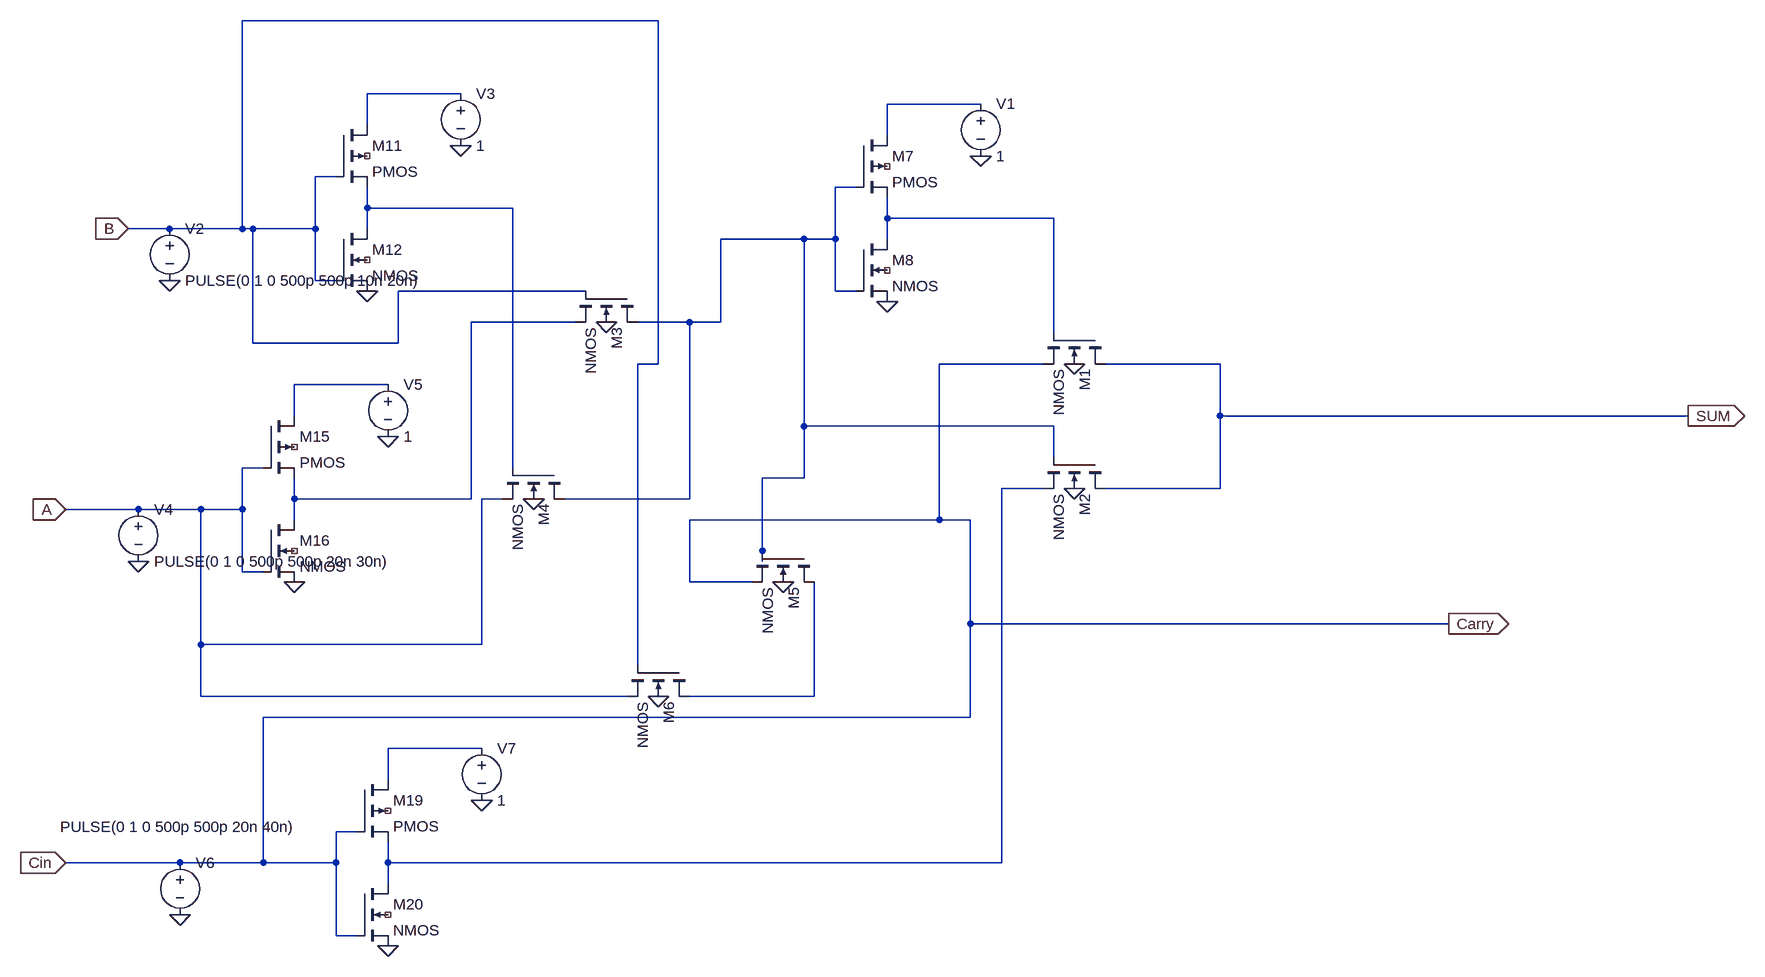
[diagram p0: schematic 6TMUXAdder.asc]
6TMUXAdder.asc, the LTspice schematic file:
Version 4
SHEET 1 1676 980
WIRE -64 -576 -704 -576
WIRE -368 -464 -512 -464
WIRE 432 -448 288 -448
WIRE -512 -416 -512 -464
WIRE 288 -400 288 -448
WIRE -560 -336 -592 -336
WIRE 240 -320 208 -320
WIRE -512 -288 -512 -320
WIRE -288 -288 -512 -288
WIRE 288 -272 288 -304
WIRE 544 -272 288 -272
WIRE -816 -256 -880 -256
WIRE -704 -256 -704 -576
WIRE -704 -256 -816 -256
WIRE -688 -256 -704 -256
WIRE -592 -256 -592 -336
WIRE -592 -256 -688 -256
WIRE -512 -256 -512 -288
WIRE 160 -240 32 -240
WIRE 208 -240 208 -320
WIRE 208 -240 160 -240
WIRE 288 -240 288 -272
WIRE -592 -176 -592 -256
WIRE -560 -176 -592 -176
WIRE -176 -160 -464 -160
WIRE 208 -160 208 -240
WIRE 240 -160 208 -160
WIRE -192 -112 -352 -112
WIRE -16 -112 -96 -112
WIRE 32 -112 32 -240
WIRE 32 -112 -16 -112
WIRE 544 -96 544 -272
WIRE -688 -80 -688 -256
WIRE -464 -80 -464 -160
WIRE -464 -80 -688 -80
WIRE -64 -48 -64 -576
WIRE -64 -48 -96 -48
WIRE 528 -48 368 -48
WIRE 800 -48 624 -48
WIRE -480 -16 -624 -16
WIRE -624 32 -624 -16
WIRE 800 32 800 -48
WIRE 1520 32 800 32
WIRE 160 48 160 -240
WIRE 544 48 160 48
WIRE 544 96 544 48
WIRE -672 112 -704 112
WIRE -288 112 -288 -288
WIRE 160 128 160 48
WIRE 160 128 96 128
WIRE 528 144 464 144
WIRE 800 144 800 32
WIRE 800 144 624 144
WIRE -624 160 -624 128
WIRE -352 160 -352 -112
WIRE -352 160 -624 160
WIRE -304 160 -336 160
WIRE -16 160 -16 -112
WIRE -16 160 -208 160
WIRE -864 176 -976 176
WIRE -768 176 -864 176
WIRE -704 176 -704 112
WIRE -704 176 -768 176
WIRE -624 192 -624 160
WIRE 368 192 368 -48
WIRE 368 192 -16 192
WIRE 416 192 368 192
WIRE 96 240 96 128
WIRE 96 256 96 240
WIRE -704 272 -704 176
WIRE -672 272 -704 272
WIRE -16 288 -16 192
WIRE 80 288 -16 288
WIRE 416 352 416 192
WIRE 1152 352 416 352
WIRE -768 384 -768 176
WIRE -336 384 -336 160
WIRE -336 384 -768 384
WIRE -96 416 -96 -48
WIRE -768 464 -768 384
WIRE -112 464 -768 464
WIRE 176 464 176 288
WIRE 176 464 -16 464
WIRE 416 496 416 352
WIRE 416 496 -672 496
WIRE -336 544 -480 544
WIRE -480 592 -480 544
WIRE -528 672 -560 672
WIRE -800 720 -976 720
WIRE -672 720 -672 496
WIRE -672 720 -800 720
WIRE -560 720 -560 672
WIRE -560 720 -672 720
WIRE -480 720 -480 688
WIRE 464 720 464 144
WIRE 464 720 -480 720
WIRE -480 752 -480 720
WIRE -560 832 -560 720
WIRE -528 832 -560 832
FLAG 288 -144 0
FLAG 432 -368 0
FLAG -512 -160 0
FLAG -368 -384 0
FLAG -624 288 0
FLAG -480 64 0
FLAG -480 848 0
FLAG -336 624 0
FLAG 576 -48 0
FLAG 576 144 0
FLAG 128 288 0
FLAG -64 464 0
FLAG -256 160 0
FLAG -144 -112 0
FLAG -976 176 A
IOPIN -976 176 In
FLAG -880 -256 B
IOPIN -880 -256 In
FLAG -976 720 Cin
IOPIN -976 720 In
FLAG -816 -176 0
FLAG -864 256 0
FLAG -800 800 0
FLAG 1520 32 SUM
IOPIN 1520 32 Out
FLAG 1152 352 Carry
IOPIN 1152 352 Out
SYMBOL nmos4 624 -96 R90
SYMATTR InstName M1
SYMBOL nmos4 624 96 R90
SYMATTR InstName M2
SYMBOL nmos4 -96 -160 R90
SYMATTR InstName M3
SYMBOL nmos4 -208 112 R90
SYMATTR InstName M4
SYMBOL nmos4 176 240 R90
SYMATTR InstName M5
SYMBOL nmos4 -16 416 R90
SYMATTR InstName M6
SYMBOL pmos4 240 -400 R0
SYMATTR InstName M7
SYMBOL nmos4 240 -240 R0
SYMATTR InstName M8
SYMBOL voltage 432 -464 R0
WINDOW 123 0 0 Left 0
WINDOW 39 0 0 Left 0
SYMATTR InstName V1
SYMATTR Value 1
SYMBOL pmos4 -560 -416 R0
SYMATTR InstName M11
SYMBOL nmos4 -560 -256 R0
SYMATTR InstName M12
SYMBOL voltage -368 -480 R0
WINDOW 123 0 0 Left 0
WINDOW 39 0 0 Left 0
SYMATTR InstName V3
SYMATTR Value 1
SYMBOL pmos4 -672 32 R0
SYMATTR InstName M15
SYMBOL nmos4 -672 192 R0
SYMATTR InstName M16
SYMBOL voltage -480 -32 R0
WINDOW 123 0 0 Left 0
WINDOW 39 0 0 Left 0
SYMATTR InstName V5
SYMATTR Value 1
SYMBOL pmos4 -528 592 R0
SYMATTR InstName M19
SYMBOL nmos4 -528 752 R0
SYMATTR InstName M20
SYMBOL voltage -336 528 R0
WINDOW 123 0 0 Left 0
WINDOW 39 0 0 Left 0
SYMATTR InstName V7
SYMATTR Value 1
SYMBOL voltage -816 -272 R0
WINDOW 123 0 0 Left 0
WINDOW 39 0 0 Left 0
SYMATTR InstName V2
SYMATTR Value PULSE(0 1 0 500p 500p 10n 20n)
SYMBOL voltage -864 160 R0
WINDOW 123 0 0 Left 0
WINDOW 39 0 0 Left 0
SYMATTR InstName V4
SYMATTR Value PULSE(0 1 0 500p 500p 20n 30n)
SYMBOL voltage -800 704 R0
WINDOW 3 -184 -39 Left 2
WINDOW 123 0 0 Left 0
WINDOW 39 0 0 Left 0
SYMATTR InstName V6
SYMATTR Value PULSE(0 1 0 500p 500p 20n 40n)

The netlist it stands for:
* 6TMUXAdder.asc
M1 SUM N005 Carry 0 NMOS
M2 SUM N003 N008 0 NMOS
M3 N003 B N006 0 NMOS
M4 N003 N004 A 0 NMOS
M5 N009 N003 Carry 0 NMOS
M6 N009 B A 0 NMOS
M7 N002 N003 N005 NC_01 PMOS
M8 N005 N003 0 NC_02 NMOS
V1 N002 0 1
M11 N001 B N004 NC_03 PMOS
M12 N004 B 0 NC_04 NMOS
V3 N001 0 1
M15 N007 A N006 NC_05 PMOS
M16 N006 A 0 NC_06 NMOS
V5 N007 0 1
M19 N010 Carry N008 NC_07 PMOS
M20 N008 Carry 0 NC_08 NMOS
V7 N010 0 1
V2 B 0 PULSE(0 1 0 500p 500p 10n 20n)
V4 A 0 PULSE(0 1 0 500p 500p 20n 30n)
V6 Carry 0 PULSE(0 1 0 500p 500p 20n 40n)
.model NMOS NMOS
.model PMOS PMOS
.lib standard.mos
.backanno
.end